# Altium schematic sheet LCL.SchDoc
size Letter
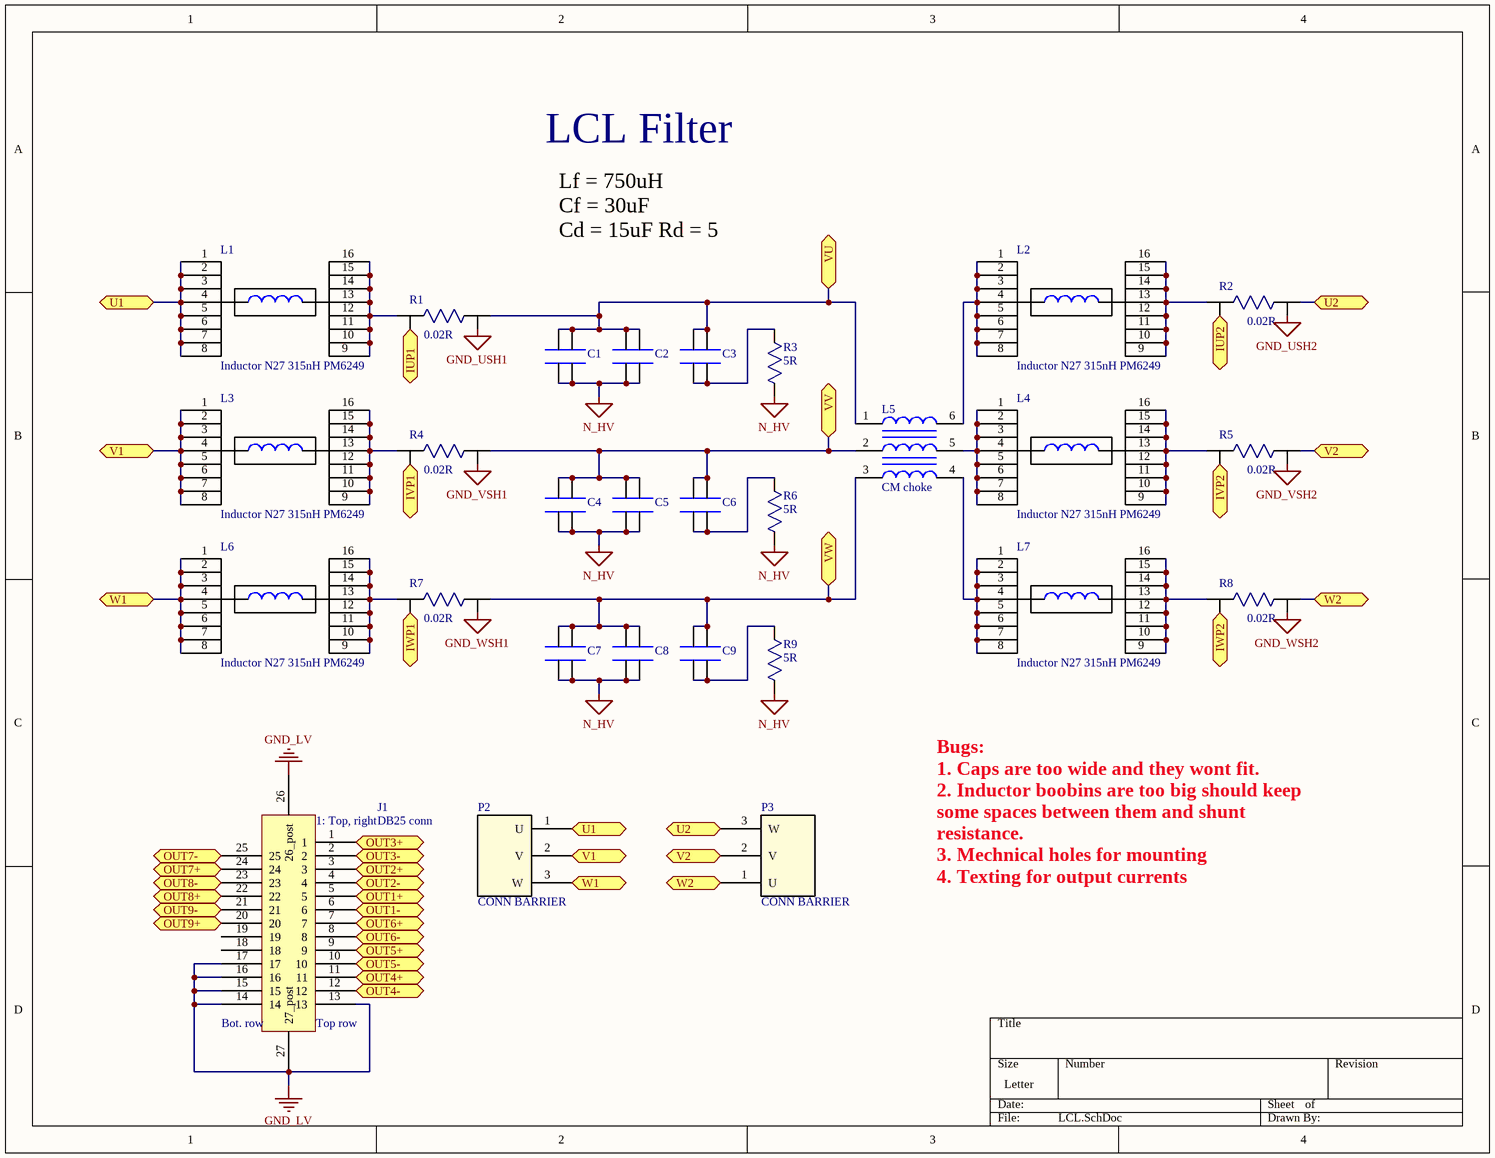
[diagram p0: LCL.SchDoc]

## Parts
C1  *  [Radial - 4 Leads]  (value not drawn)
C2  *  [Radial - 4 Leads]  (value not drawn)
C3  *  [Radial - 4 Leads]  (value not drawn)
C4  *  [Radial - 4 Leads]  (value not drawn)
C5  *  [Radial - 4 Leads]  (value not drawn)
C6  *  [Radial - 4 Leads]  (value not drawn)
C7  *  [Radial - 4 Leads]  (value not drawn)
C8  *  [Radial - 4 Leads]  (value not drawn)
C9  *  [Radial - 4 Leads]  (value not drawn)
J1  DB25 conn  [Connector D-Sub Receptacle 25 pos]
L1  Inductor N27 315nH PM6249  [IND_PM6249]
L2  Inductor N27 315nH PM6249  [IND_PM6249]
L3  Inductor N27 315nH PM6249  [IND_PM6249]
L4  Inductor N27 315nH PM6249  [IND_PM6249]
L5  CM choke  [CM Choke]
L6  Inductor N27 315nH PM6249  [IND_PM6249]
L7  Inductor N27 315nH PM6249  [IND_PM6249]
P2  CONN BARRIER  [Terminal Barrier 3PIN]
P3  CONN BARRIER  [Terminal Barrier 3PIN]
R1  value 0.02R  [Res Precision CSM3637Z]  (hidden comment: Resistor Precision)
R2  value 0.02R  [Res Precision CSM3637Z]  (hidden comment: Resistor Precision)
R3  value 5R  [Axial 50mm]  (hidden comment: Resistor Power)
R4  value 0.02R  [Res Precision CSM3637Z]  (hidden comment: Resistor Precision)
R5  value 0.02R  [Res Precision CSM3637Z]  (hidden comment: Resistor Precision)
R6  value 5R  [Axial 50mm]  (hidden comment: Resistor Power)
R7  value 0.02R  [Res Precision CSM3637Z]  (hidden comment: Resistor Precision)
R8  value 0.02R  [Res Precision CSM3637Z]  (hidden comment: Resistor Precision)
R9  value 5R  [Axial 50mm]  (hidden comment: Resistor Power)

## Ports
IUP1, IUP2, IVP1, IVP2, IWP1, IWP2, OUT1+, OUT1-, OUT2+, OUT2-, OUT3+, OUT3-, OUT4+, OUT4-, OUT5+, OUT5-, OUT6+, OUT6-, OUT7+, OUT7-, OUT8+, OUT8-, OUT9+, OUT9-, U1, U2, V1, V2, VU, VV, VW, W1, W2

## Nets
GND_LV: J1.13 J1.14 J1.15 J1.16 J1.17 J1.26(26_post) J1.27(27_post)
GND_USH1: R1.2
GND_USH2: R2.2
GND_VSH1: R4.2
GND_VSH2: R5.2
GND_WSH1: R7.2
GND_WSH2: R8.2
N_HV: C1.1(OUT) C1.2(OUT) C2.1(OUT) C2.2(OUT) C4.1(OUT) C4.2(OUT) C5.1(OUT) C5.2(OUT) C7.1(OUT) C7.2(OUT) C8.1(OUT) C8.2(OUT) R3.1 R6.1 R9.1
IUP1: R1.3 ; port IUP1
IUP2: R2.3 ; port IUP2
IVP1: R4.3 ; port IVP1
IVP2: R5.3 ; port IVP2
IWP1: R7.3 ; port IWP1
IWP2: R8.3 ; port IWP2
OUT1+: J1.5 ; port OUT1+
OUT1-: J1.6 ; port OUT1-
OUT2+: J1.3 ; port OUT2+
OUT2-: J1.4 ; port OUT2-
OUT3+: J1.1 ; port OUT3+
OUT3-: J1.2 ; port OUT3-
OUT4+: J1.11 ; port OUT4+
OUT4-: J1.12 ; port OUT4-
OUT5+: J1.9 ; port OUT5+
OUT5-: J1.10 ; port OUT5-
OUT6+: J1.7 ; port OUT6+
OUT6-: J1.8 ; port OUT6-
OUT7+: J1.24 ; port OUT7+
OUT7-: J1.25 ; port OUT7-
OUT8+: J1.22 ; port OUT8+
OUT8-: J1.23 ; port OUT8-
OUT9+: J1.20 ; port OUT9+
OUT9-: J1.21 ; port OUT9-
U1: L1.1 L1.2 L1.3 L1.4 L1.5 L1.6 L1.7 L1.8 P2.1(U) ; port U1
U2: P3.3(W) R2.1 ; port U2
V1: L3.1 L3.2 L3.3 L3.4 L3.5 L3.6 L3.7 L3.8 P2.2(V) ; port V1
V2: P3.2(V) R5.1 ; port V2
VU: C1.3(OUT) C1.4(OUT) C2.3(OUT) C2.4(OUT) C3.3(OUT) C3.4(OUT) L5.1 R1.1 ; port VU
VV: C4.3(OUT) C4.4(OUT) C5.3(OUT) C5.4(OUT) C6.3(OUT) C6.4(OUT) L5.2 R4.1 ; port VV
VW: C7.3(OUT) C7.4(OUT) C8.3(OUT) C8.4(OUT) C9.3(OUT) C9.4(OUT) L5.3 R7.1 ; port VW
W1: L6.1 L6.2 L6.3 L6.4 L6.5 L6.6 L6.7 L6.8 P2.3(W) ; port W1
W2: P3.1(U) R8.1 ; port W2
NetC3_1: C3.1(OUT) C3.2(OUT) R3.2
NetC6_1: C6.1(OUT) C6.2(OUT) R6.2
NetC9_1: C9.1(OUT) C9.2(OUT) R9.2
NetL1_9: L1.9 L1.10 L1.11 L1.12 L1.13 L1.14 L1.15 L1.16 R1.4
NetL2_1: L2.1 L2.2 L2.3 L2.4 L2.5 L2.6 L2.7 L2.8 L5.6
NetL2_9: L2.9 L2.10 L2.11 L2.12 L2.13 L2.14 L2.15 L2.16 R2.4
NetL3_9: L3.9 L3.10 L3.11 L3.12 L3.13 L3.14 L3.15 L3.16 R4.4
NetL4_1: L4.1 L4.2 L4.3 L4.4 L4.5 L4.6 L4.7 L4.8 L5.5
NetL4_9: L4.9 L4.10 L4.11 L4.12 L4.13 L4.14 L4.15 L4.16 R5.4
NetL5_4: L5.4 L7.1 L7.2 L7.3 L7.4 L7.5 L7.6 L7.7 L7.8
NetL6_9: L6.9 L6.10 L6.11 L6.12 L6.13 L6.14 L6.15 L6.16 R7.4
NetL7_9: L7.9 L7.10 L7.11 L7.12 L7.13 L7.14 L7.15 L7.16 R8.4

Not connected (* = marked no-connect by the designer): J1 18 19

## Notes on the sheet
- LCL Filter
- Lf = 750uH
  Cf = 30uF
  Cd = 15uF Rd = 5
  Lm = 300uH
- Bugs:
  1. Caps are too wide and they wont fit.
  2. Inductor boobins are too big should keep some spaces between them and shunt resistance.
  3. Mechnical holes for mounting
  4. Texting for output currents
- (in symbol Conn D-Sub Receptacle 25 positions) 1: Top, right; Bot. row; Top row

## Library data of the parts
C1-C9 = Cap Film Radial - 4 Leads: Radial - 4 Leads; Part: BC2763-ND
J1 = Conn D-Sub Receptacle 25 positions: D-Sub Receptacle 25 Position A35111-ND; Part: A35111-ND
L5 = CMC 1.5MH 20A: CMC 1.5MH 20A 3LN TH; Part: B82747E6203A40
P2 P3 = Terminal Blocks - Barrier Blocks: CONN BARRIER STRIP 3CIRC 0.325"; Part: WM4246-ND
R1 R2 R4 R5 R7 R8 = Resistor Precision: RES SMD 0.02 OHM 0.1% 2W 3637; Part: Y1473-.02CCT-ND
R3 R6 R9 = Resistor Power: RES 5.0 OHM 10W 1% WW AXIAL; Part: RSD-5.0RCT-ND